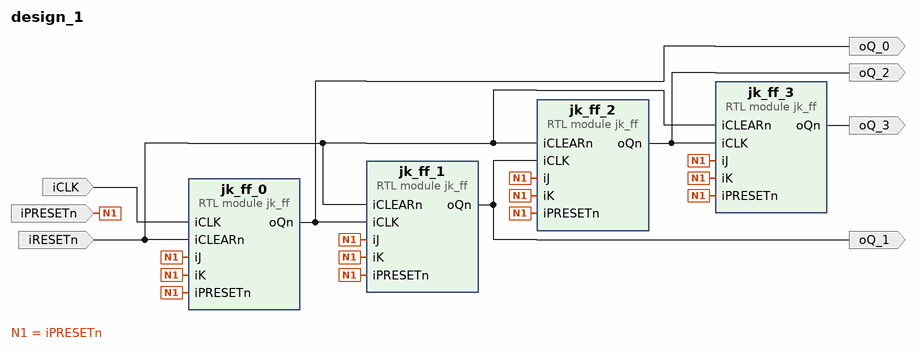
[diagram p0: block diagram of the top level]
# Vivado block design design_1, xc7a35tcpg236-1, Vivado 2022.2
create_bd_design design_1

create_bd_port -dir I iCLK
create_bd_port -dir I iRESETn
create_bd_port -dir I iPRESETn
create_bd_port -dir O oQ_0
create_bd_port -dir O oQ_1
create_bd_port -dir O oQ_3
create_bd_port -dir O oQ_2

create_bd_cell -type module -reference jk_ff jk_ff_0
create_bd_cell -type module -reference jk_ff jk_ff_1
create_bd_cell -type module -reference jk_ff jk_ff_2
create_bd_cell -type module -reference jk_ff jk_ff_3

# ---- connections ----

connect_bd_net [get_bd_ports iCLK] [get_bd_pins jk_ff_0/iCLK]
connect_bd_net [get_bd_ports iPRESETn] \
  [get_bd_pins jk_ff_0/iPRESETn] [get_bd_pins jk_ff_0/iJ] [get_bd_pins jk_ff_0/iK] [get_bd_pins jk_ff_1/iJ] \
  [get_bd_pins jk_ff_1/iK] [get_bd_pins jk_ff_2/iJ] [get_bd_pins jk_ff_2/iK] [get_bd_pins jk_ff_3/iJ] \
  [get_bd_pins jk_ff_3/iK] [get_bd_pins jk_ff_2/iPRESETn] [get_bd_pins jk_ff_3/iPRESETn] [get_bd_pins jk_ff_1/iPRESETn]
connect_bd_net [get_bd_ports iRESETn] \
  [get_bd_pins jk_ff_0/iCLEARn] [get_bd_pins jk_ff_1/iCLEARn] [get_bd_pins jk_ff_2/iCLEARn] [get_bd_pins jk_ff_3/iCLEARn]
connect_bd_net [get_bd_pins jk_ff_0/oQn] [get_bd_pins jk_ff_1/iCLK] [get_bd_ports oQ_0]
connect_bd_net [get_bd_pins jk_ff_1/oQn] [get_bd_pins jk_ff_2/iCLK] [get_bd_ports oQ_1]
connect_bd_net [get_bd_pins jk_ff_2/oQn] [get_bd_pins jk_ff_3/iCLK] [get_bd_ports oQ_2]
connect_bd_net [get_bd_pins jk_ff_3/oQn] [get_bd_ports oQ_3]

validate_bd_design
save_bd_design
